# Altium schematic sheet [4]_Power_Supply.SchDoc: Power Supply
size A3; Author: Eladio Delgado; CompanyName: bq - Mundo Reader; Organization: bq - Mundo Reader; Revision: 0; SheetNumber: 4; SheetTotal: 5
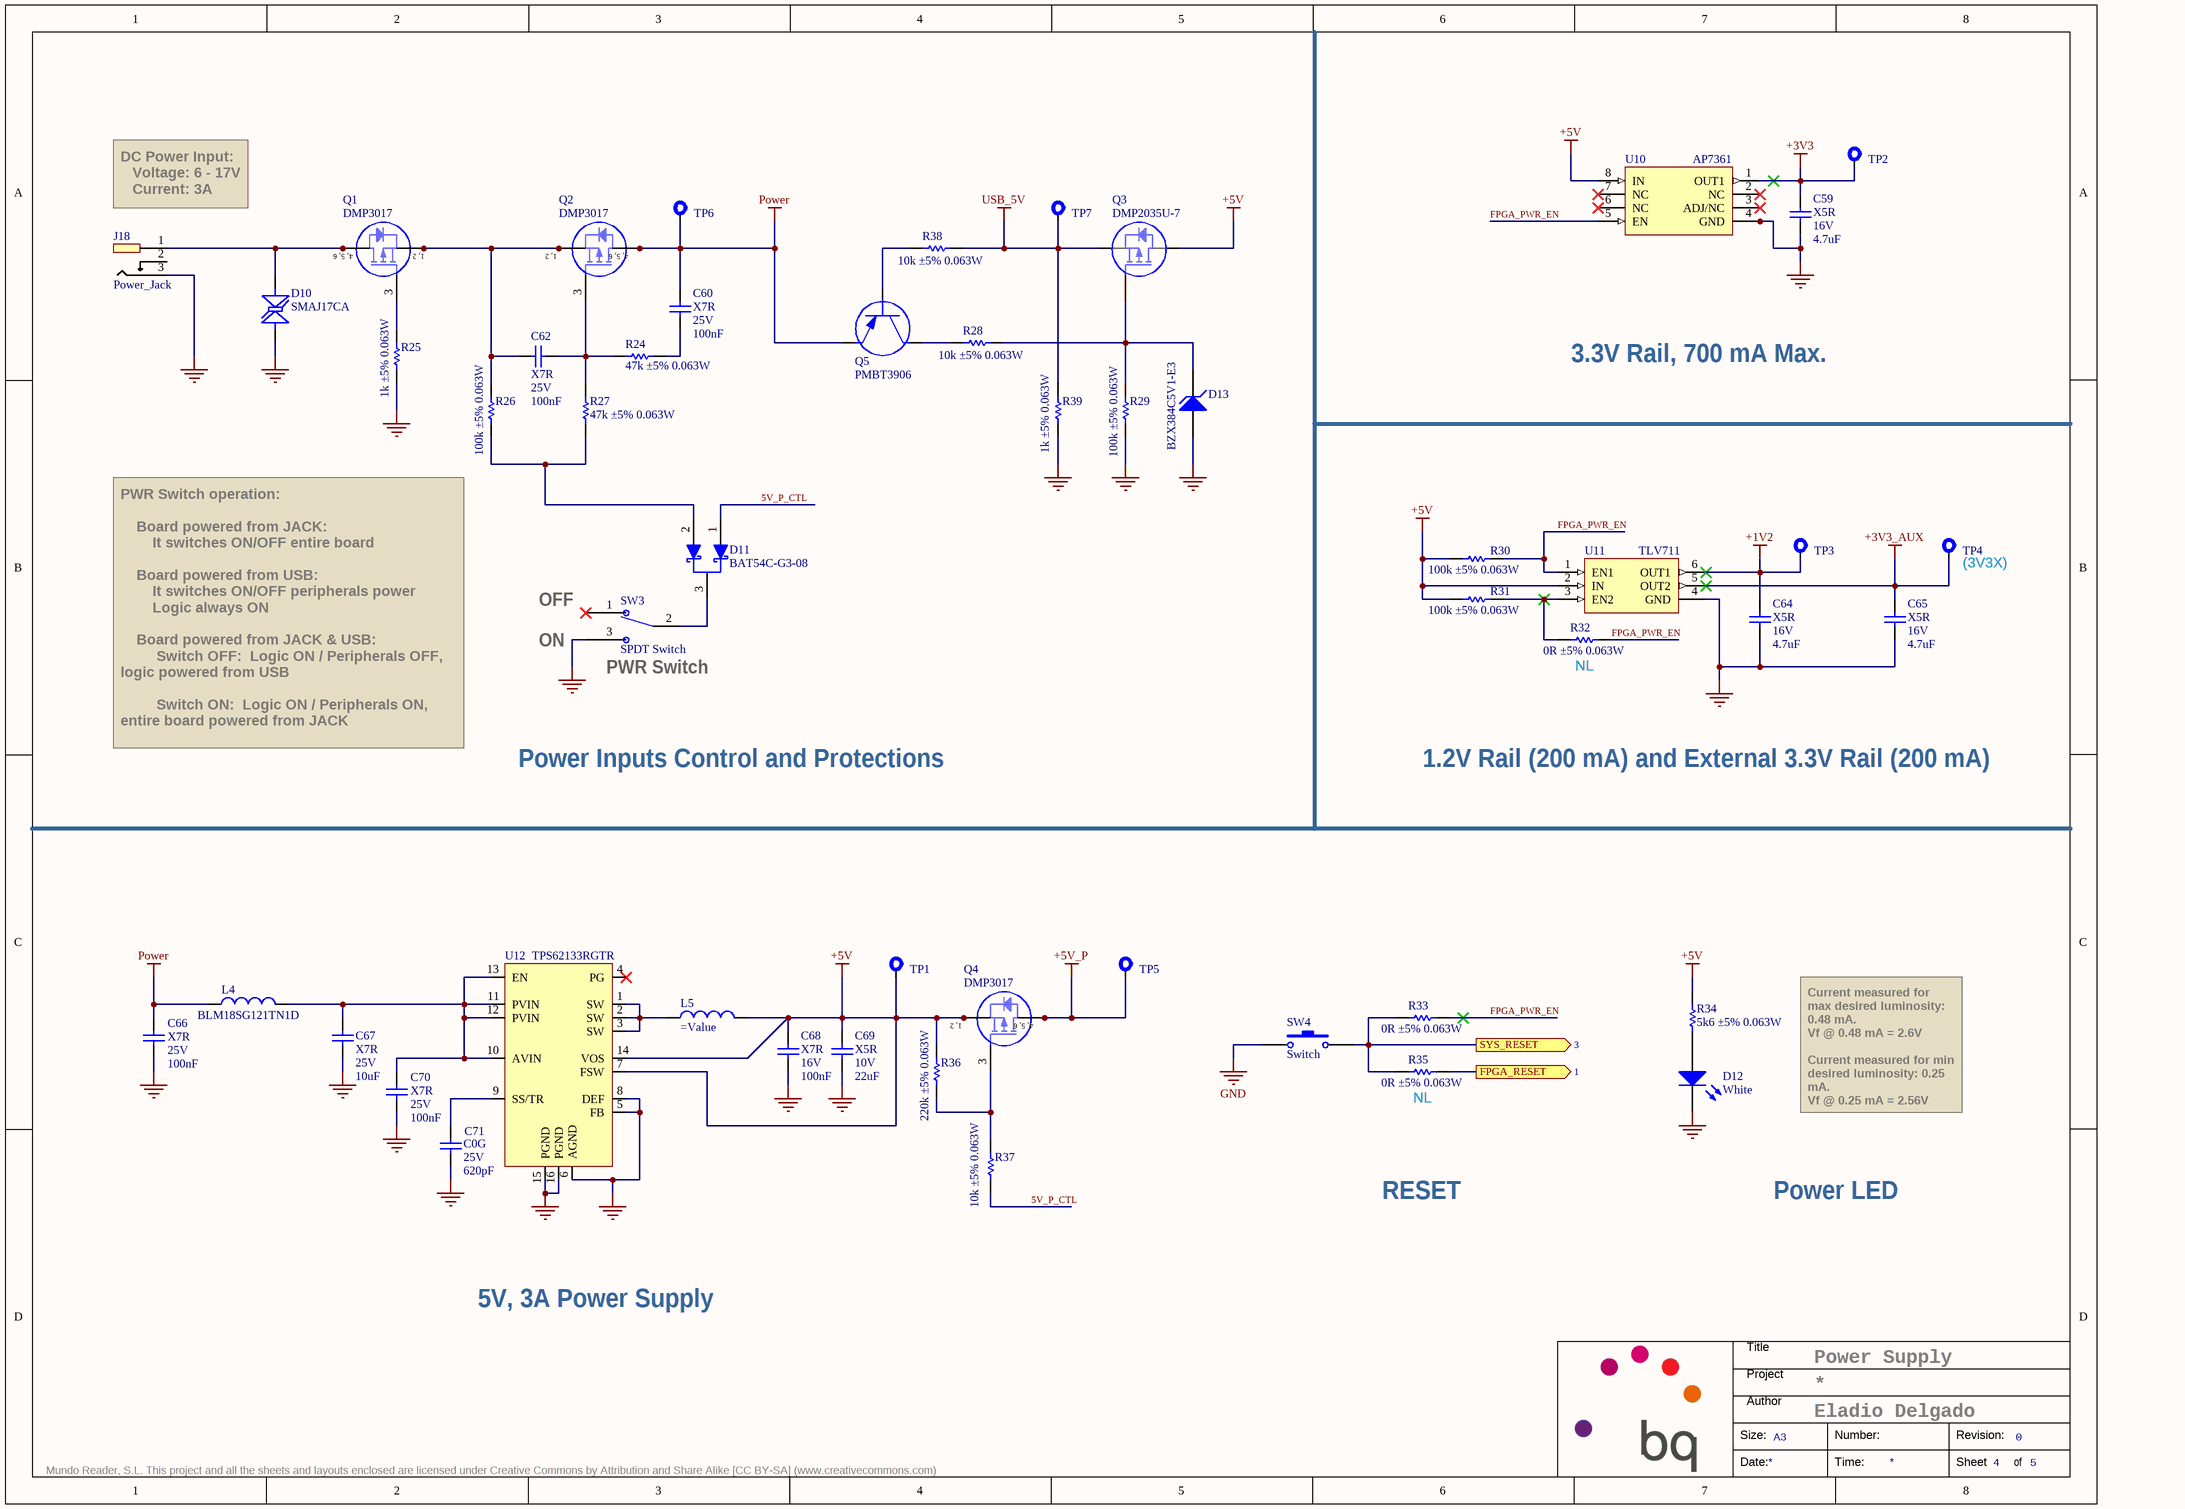
[diagram p0: [4]_Power_Supply.SchDoc]

## Parts
C59  Dielectric: X5R  Voltage: 16V  Capacitance: 4.7uF  [C0603]  (hidden comment: Capacitor)
C60  Dielectric: X7R  Voltage: 25V  Capacitance: 100nF  [C0603]  (hidden comment: Capacitor)
C62  Dielectric: X7R  Voltage: 25V  Capacitance: 100nF  [C0603]  (hidden comment: Capacitor)
C64  Dielectric: X5R  Voltage: 16V  Capacitance: 4.7uF  [C0603]  (hidden comment: Capacitor)
C65  Dielectric: X5R  Voltage: 16V  Capacitance: 4.7uF  [C0603]  (hidden comment: Capacitor)
C66  Dielectric: X7R  Voltage: 25V  Capacitance: 100nF  [C0603]  (hidden comment: Capacitor)
C67  Dielectric: X7R  Voltage: 25V  Capacitance: 10uF  [C1206]  (hidden comment: Capacitor)
C68  Dielectric: X7R  Voltage: 16V  Capacitance: 100nF  [C0402]  (hidden comment: Capacitor)
C69  Dielectric: X5R  Voltage: 10V  Capacitance: 22uF  [C1206]  (hidden comment: Capacitor)
C70  Dielectric: X7R  Voltage: 25V  Capacitance: 100nF  [C0603]  (hidden comment: Capacitor)
C71  Dielectric: C0G  Voltage: 25V  Capacitance: 620pF  [C0603]  (hidden comment: Capacitor)
D10  SMAJ17CA  [DO-214AC-SMA]
D11  BAT54C-G3-08  [SOT23-3]
D12  White  [LED0603]
D13  BZX384C5V1-E3  [SOD323]
J18  Power_Jack  [Jack 2.1]
L4  BLM18SG121TN1D  [L0603]
L5  (no value)  [L4040]
Q1  DMP3017  [U-DFN2523-6]
Q2  DMP3017  [U-DFN2523-6]
Q3  DMP2035U-7  [SOT23-3]
Q4  DMP3017  [U-DFN2523-6]
Q5  PMBT3906  [SOT23-3]
R24  value 47k ±5% 0.063W  [R0402]  (hidden comment: Resistor)
R25  value 1k ±5% 0.063W  [R0402]  (hidden comment: Resistor)
R26  value 100k ±5% 0.063W  [R0402]  (hidden comment: Resistor)
R27  value 47k ±5% 0.063W  [R0402]  (hidden comment: Resistor)
R28  value 10k ±5% 0.063W  [R0402]  (hidden comment: Resistor)
R29  value 100k ±5% 0.063W  [R0402]  (hidden comment: Resistor)
R30  value 100k ±5% 0.063W  [R0402]  (hidden comment: Resistor)
R31  value 100k ±5% 0.063W  [R0402]  (hidden comment: Resistor)
R32  value 0R ±5% 0.063W  [R0402]  (hidden comment: Resistor)
R33  value 0R ±5% 0.063W  [R0402]  (hidden comment: Resistor)
R34  value 5k6 ±5% 0.063W  [R0402]  (hidden comment: Resistor)
R35  value 0R ±5% 0.063W  [R0402]  (hidden comment: Resistor)
R36  value 220k ±5% 0.063W  [R0402]  (hidden comment: Resistor)
R37  value 10k ±5% 0.063W  [R0402]  (hidden comment: Resistor)
R38  value 10k ±5% 0.063W  [R0402]  (hidden comment: Resistor)
R39  value 1k ±5% 0.063W  [R0402]  (hidden comment: Resistor)
SW3  SPDT Switch  [Slide SW SPDT Right Angle]
SW4  Switch  [SW_Vert_THT_7.5x6x6.5]
TP1  Testpoint  [TP_SMD_1mm]  (value not drawn)  (no BOM)
TP2  Testpoint  [TP_SMD_1mm]  (value not drawn)  (no BOM)
TP3  Testpoint  [TP_SMD_1mm]  (value not drawn)  (no BOM)
TP4  Testpoint  [TP_SMD_1mm]  (value not drawn)  (no BOM)
TP5  Testpoint  [TP_SMD_1mm]  (value not drawn)  (no BOM)
TP6  Testpoint  [TP_SMD_1mm]  (value not drawn)  (no BOM)
TP7  Testpoint  [TP_SMD_1mm]  (value not drawn)  (no BOM)
U10  AP7361  [U-DFN3030-8]
U11  TLV711  [WSON-6-1,5x1,5mm]
U12  TPS62133RGTR  [QFN16]

## Ports
FPGA_RESET (out, see 1), SYS_RESET (out, see 3)

## Nets
+1V2: C64.2 TP3.1 U11.6(OUT1)
+3V3: C59.2 TP2.1 U10.1(OUT1)
+3V3_AUX: C65.2 TP4.1 U11.5(OUT2)
+5V: C68.2 C69.2 L5.2 Q3.3(D) Q4.1(S) Q4.2(S) R30.1 R31.1 R34.2 R36.1 TP1.1 U10.8(IN) U11.2(IN) U12.7(FSW) U12.14(VOS)
+5V_P: Q4.4(D) Q4.5(D) Q4.6(D) TP5.1
GND: C59.1 C64.1 C65.1 C66.1 C67.1 C68.1 C69.1 C70.1 C71.1 D10.A D12.K D13.A J18.3 R25.2 R29.1 R39.1 SW3.3 SW4.2 U10.0(TP) U10.4(GND) U11.4(GND) U12.5(FB) U12.6(AGND) U12.8(DEF) U12.15(PGND) U12.16(PGND)
Power: C60.2 C66.2 L4.1 Q2.4(D) Q2.5(D) Q2.6(D) Q5.2(E) TP6.1
USB_5V: Q3.2(S) R38.2 R39.2 TP7.1
5V_P_CTL: D11.1(A1) R37.2
FPGA_PWR_EN: R30.2 R32.2 R33.2 U10.5(EN) U11.1(EN1)
FPGA_RESET: R35.2 ; port FPGA_RESET
SYS_RESET: R33.1 R35.1 SW4.1 ; port SYS_RESET
NetC60_1: C60.1 R24.2
NetC62_1: C62.1 Q2.3(G) R24.1 R27.1
NetC62_2: C62.2 Q1.1(S) Q1.2(S) Q2.1(S) Q2.2(S) R26.1
NetC67_2: C67.2 C70.2 L4.2 U12.10(AVIN) U12.11(PVIN) U12.12(PVIN) U12.13(EN)
NetC71_2: C71.2 U12.9(SS/TR)
NetD10_K: D10.K J18.1 Q1.4(D) Q1.5(D) Q1.6(D)
NetD11_2: D11.2(A2) R26.2 R27.2
NetD11_3: D11.3(K) SW3.2
NetD12_A: D12.A R34.1
NetD13_k: D13.k(K) Q3.1(G) R28.2 R29.2
NetL5_1: L5.1 U12.1(SW) U12.2(SW) U12.3(SW)
NetQ1_3: Q1.3(G) R25.1
NetQ4_3: Q4.3(G) R36.2 R37.1
NetQ5_1: Q5.1(B) R38.1
NetQ5_3: Q5.3(C) R28.1
NetR31_2: R31.2 R32.1 U11.3(EN2)

Not connected (* = marked no-connect by the designer): J18 2; SW3 1*; U10 2(NC)* 3(ADJ/NC)* 6(NC)* 7(NC)*; U12 4(PG)*

## Notes on the sheet
- (near J18) DC Power Input:
  Voltage: 6 - 17V
  Current: 3A
- 3.3V Rail, 700 mA Max.
- (near TP4) (3V3X)
- ON
- OFF
- (near SW3) PWR Switch
- (near R32) NL
- PWR Switch operation:
  Board powered from JACK:
  It switches ON/OFF entire board
  Board powered from USB:
  It switches ON/OFF peripherals power
  Logic always ON
  Board powered from JACK & USB:
  Switch OFF: 	Logic ON / Peripherals OFF,                            		logic powered from USB
  Switch ON: 	Logic ON / Peripherals ON,                                   		entire board powered from JACK
- Power Inputs Control and Protections
- 1.2V Rail (200 mA) and External 3.3V Rail (200 mA)
- (near R35) NL
- Current measured for max desired luminosity: 0.48 mA.
  Vf @ 0.48 mA = 2.6V
  Current measured for min desired luminosity: 0.25 mA.
  Vf @ 0.25 mA = 2.56V
  R=5 to 9K6
- RESET
- Power LED
- 5V, 3A Power Supply
- Title
- Project
- Size:
- Author
- A3
- Number:
- Revision:
- Mundo Reader, S.L. This project and all the sheets and layouts enclosed are licensed under Creative Commons by Attribution and Share Alike [CC BY-SA] (www.creativecommons.com)
- Date:
- Time:
- Sheet
- of
- (in symbol DMP3017) 4, 5, 6; 1, 2

## Library data of the parts
C59 C64 C65 = C0603_4.7uF_16V_±10%: Capacitor SMD; Manufacturer: TDK; Value: 4.7uF ±10% 16V; Tolerance: ±10%; OrderingCode: C1608X5R1C475K080AC; Temp_ Max: 85; Temp_ Min: -55; Part Number: C0603_4.7uF_16V_±10%; Price (€): 0,068
C60 C62 = C0603_100nF_25V_±10%: Capacitor SMD; Manufacturer: Kemet; Value: 100nF ±10% 25V; Tolerance: ±10%; OrderingCode: C0603C104K3RAC; Temp_ Max: 125; Temp_ Min: -55; Part Number: C0603_100nF_25V_±10%; Price (€): 0,035
C66 C70 = C0603_100nF_25V_±10%: Manufacturer: Kemet; Value: 100nF ±10% 25V; Tolerance: ±10%; OrderingCode: C0603C104K3RAC; Temp_ Max: 125; Temp_ Min: -55; Part Number: C0603_100nF_25V_±10%; Price (€): 0,035
C67 = C1206_10uF_25V_±10%: Capacitor SMD; Manufacturer: Taiyo Yuden; Value: 10uF ±10% 25V; Tolerance: ±10%; OrderingCode: TMK316B7106KL-TD; Temp_ Max: 125; Temp_ Min: -55; Part Number: C1206_10uF_25V_±10%; Price (€): 0,066
C68 = C0402_100nF_16V_±10%: Capacitor SMD; Manufacturer: Kemet; Value: 100nF ±10% 16V; Tolerance: ±10%; OrderingCode: C0402C104K4RAC; Temp_ Max: 125; Temp_ Min: -55; Part Number: C0402_100nF_16V_±10%; Price (€): 0,05
C69 = C1206_22uF_10V_±20%: Manufacturer: Taiyo Yuden; Value: 22uF ±20% 10V; Tolerance: ±20%; OrderingCode: LMK316ABJ226ML-T; Temp_ Max: 85; Temp_ Min: -55; Part Number: C1206_22uF_10V_±20%; Price (€): 0,094
C71 = C0603_620pF_25V_±5%: Manufacturer: Murata; Value: 620pF ±5% 25V; Tolerance: ±5%; OrderingCode: GRM1885C1E621JA01D; Temp_ Max: 125; Temp_ Min: -55; Part Number: C0603_620pF_25V_±5%; Price (€): 0,023
D10 = TVS 17V Bi SMA: Protection, Bidirectional Transient Suppression Diodes; Manufacturer: Bourns; Voltage: 17V; Breakdown Voltage: 18,9V; Overvoltage Current: 14,5A; Temp_ Max: 150; Temp_ Min: -55; Part Number: TVS 17V Bi SMA; OrderingCode: SMAJ17CA; Price (€): 0,113; Manufacturer 2: Littelfuse; OrderingCode 2: SMAJ17CA
D11 = BAT54C: Dual Schottky Diode Common Cathode; Part Number: BAT54C; Manufacturer: Vishay; Ifor: 200mA; Vrrm: 30V; Ifsm: 600mA; Vf: 0,8V; Temp_ Max: 125; Temp_ Min: -55; Value: 200mA 30V; OrderingCode: BAT54C-G3-08; Price (€): 0,042; Manufacturer 2: Fairchild; OrderingCode 2: BAT54C
D12 = LW Q38G-Q2R3: LED; Manufacturer: OSRAM Opto; OrderingCode: LW Q38G-Q2R2-3K5L-1; Temp_ Max: 85; Temp_ Min: -40; Part Number: LW Q38G-Q2R3; Price (€): 0,1; Value: White
D13 = BZX384C5V1: Zener Diode; Manufacturer: Vishay; Vzener: 5V1; Tolerance: 0,05; Izener: 5mA; Power: 200mW; Temp_ Max: 150; Temp_ Min: -55; OrderingCode 2: BZX384B5V1-E3; Value: 5V1; Part Number: BZX384C5V1; OrderingCode: BZX384C5V1-E3; Price (€): 0,024; Manufacturer 2: Vishay
J18 = DC Power Jack: Connector, Power, DC Power Jack; Manufacturer: Kycon; Idc: 5A; OrderingCode: KLDHCX0202A; OrderingCode 2: RAPC722X; Part Number: DC Power Jack; Supplier: Avnet; Price (€): 0,2673; Manufacturer 2: Switchcraft
L4 = L0603_120R_0,025R_3000mA: Ferrite Bead; Manufacturer: Murata; Resistance_100MHz: 120R; Resistance_DC: 0,025R; Current: 3000mA; Temp_ Max: 125; Temp_ Min: -55; Value: 120R 0,025R 3000mA; Part Number: L0603_120R_0,025R_3000mA; OrderingCode: BLM18SG121TN1D; Price (€): 0,053
L5 = 2,2uH_4,7A: Inductor SMD; Manufacturer: Würth Elektronik; L: 2,2uH; Rdc: 0,029R; Current: 4,7A; Current Sat#: 6,2A; OrderingCode: 74438356022; Temp_ Max: 125; Temp_ Min: -40; OrderingCode 2: XAL4020-222MEB; Value: 2,2uH 4,7A; Part Number: 2,2uH_4,7A; Supplier: Würth; Price (€): 1,22; Manufacturer 2: Coilcraft
Q1 Q2 Q4 = DMP3017: P-Channel MOSFET, 6 pin; Manufacturer: Diodes Incorporated; Vds: 30V; Vgss: 25V; Id: 10,4A; OrderingCode: DMP3017SFK-7; Temp_ Max: 150; Temp_ Min: -55; Part Number: DMP3017; Supplier: Silica; Price (€): 0,256
Q3 = DMP2035U: PFET; Manufacturer: Diodes Incorporated; Vds: 20V; Vgss: 8V; Id: 3,6A; Temp_ Max: 150; Temp_ Min: -55; Part Number: DMP2035U; OrderingCode: DMP2035U-7; Supplier: Silica; Price (€): 0,08
Q5 = PMBT3906: PNP; Manufacturer: NXP; Vcbo: -40V; Vebo: -6V; Ic: 200mA; OrderingCode: PMBT3906,215; Temp_ Max: 150; Temp_ Min: -65; Part Number: PMBT3906; Vceo: -40V; Price (€): 0,019
R24 R27 = R0402_47k_0.063W_±5%: Resistor, SMD; Manufacturer: Vishay; Tolerance: ±5%; OrderingCode: CRCW040247K0JN; Power: 0.063W; Resistance: 47k; Temp_ Max: 155; Temp_ Min: -55; PackageDescription: SMD; Part Number: R0402_47k_0.063W_±5%; Price (€): 0,003
R25 R39 = R0402_1k_0.063W_±5%: Resistor, SMD; Manufacturer: Vishay; Tolerance: ±5%; OrderingCode: CRCW04021K00JN; Power: 0.063W; Resistance: 1k; Temp_ Max: 155; Temp_ Min: -55; PackageDescription: SMD; Part Number: R0402_1k_0.063W_±5%; Price (€): 0,003
R26 R29-R31 = R0402_100k_0.063W_±5%: Resistor, SMD; Manufacturer: Vishay; Tolerance: ±5%; OrderingCode: CRCW0402100KJN; Power: 0.063W; Resistance: 100k; Temp_ Max: 155; Temp_ Min: -55; PackageDescription: SMD; Part Number: R0402_100k_0.063W_±5%; Price (€): 0,003
R28 R37 R38 = R0402_10k_0.063W_±5%: Resistor, SMD; Manufacturer: Vishay; Tolerance: ±5%; OrderingCode: CRCW040210K0JN; Power: 0.063W; Resistance: 10k; Temp_ Max: 155; Temp_ Min: -55; PackageDescription: SMD; Part Number: R0402_10k_0.063W_±5%; Price (€): 0,003
R32 R33 R35 = R0402_0R_0.063W_±5%: Resistor, SMD; Manufacturer: Panasonic; Tolerance: ±5%; OrderingCode: ERJ-2GE0R00X; Power: 0.063W; Resistance: 0R; Temp_ Max: 155; Temp_ Min: -55; OrderingCode 2: CRCW04020000Z0; PackageDescription: SMD; Part Number: R0402_0R_0.063W_±5%; Price (€): 0,003; Manufacturer 2: Vishay
R34 = R0402_5k6_0.063W_±5%: Resistor, SMD; Manufacturer: Vishay; Tolerance: ±5%; OrderingCode: CRCW04025K60JN; Power: 0.063W; Resistance: 5k6; Temp_ Max: 155; Temp_ Min: -55; PackageDescription: SMD; Part Number: R0402_5k6_0.063W_±5%; Price (€): 0,003
R36 = R0402_220k_0.063W_±5%: Resistor, SMD; Manufacturer: Vishay; Tolerance: ±5%; OrderingCode: CRCW0402220KJN; Power: 0.063W; Resistance: 220k; Temp_ Max: 155; Temp_ Min: -55; PackageDescription: SMD; Part Number: R0402_220k_0.063W_±5%; Price (€): 0,003
SW3 = Switch SPDT: Manufacturer: Würth Elektronik; OrderingCode: 450 302 014 072; Temp_ Max: 85; Temp_ Min: -40; OrderingCode 2: MMP1010D-RA; Part Number: Switch SPDT; Supplier: Würth; Price (€): 0,4144; Manufacturer 2: Knitter-Switch
SW4 = SW Vertical THT: Micro miniature pushbutton surface Switch; Manufacturer: C&K Components; OrderingCode: PTS645VL39-2 LFS; Temp_ Max: 60; Temp_ Min: -20; Part Number: SW Vertical THT; Price (€): 0,104; Supplier: Abacus
TP1-TP7 = TP_SMD_1mm: Manufacturer: Oxley; OrderingCode: SMOX/060/B1; SAP: 303552; Part Number: TP_SMD_1mm
U10 = AP7361: LDO Regulator, 8 pin, adjustable and fixed mode with enable; Manufacturer: Diodes Inc.; Voltage IN: 2,2÷6 VDC; Voltage OUT: 3.3VDC; Current OUT: 1A; OrderingCode: AP7361-33FGE-7; Temp_ Max: 85; Temp_ Min: -40; Part Number: AP7361; Supplier: Silica; Price (€): 0,187
U11 = TLV711: LDO Regulator, Dual, 6 pin; Manufacturer: Texas Instruments; Voltage IN: 2÷5,5 VDC; Voltage OUT: 1,2 & 3,3 V; Current OUT: 200 & 200 mA; OrderingCode: TLV7111233DSER; Temp_ Max: 125; Temp_ Min: -40; Part Number: TLV711; Supplier: Silica; Price (€): 0,224
U12 = TPS62133: 3A High Efficient Synchronous Step Down Converter with DCS™ Control; Manufacturer: Texas Instruments; Voltage IN: 3÷17 VDC; Voltage OUT: 0,9÷6 VDC; Temp_ Max: 85; Temp_ Min: -40; Part Number: TPS62133; Current OUT: 3A; OrderingCode: TPS62133RGTR; Supplier: Silica; Price (€): 1,5